# EAGLE design cryobondr-sense1-vlaqc-test1 (EAGLE 8.4.1)
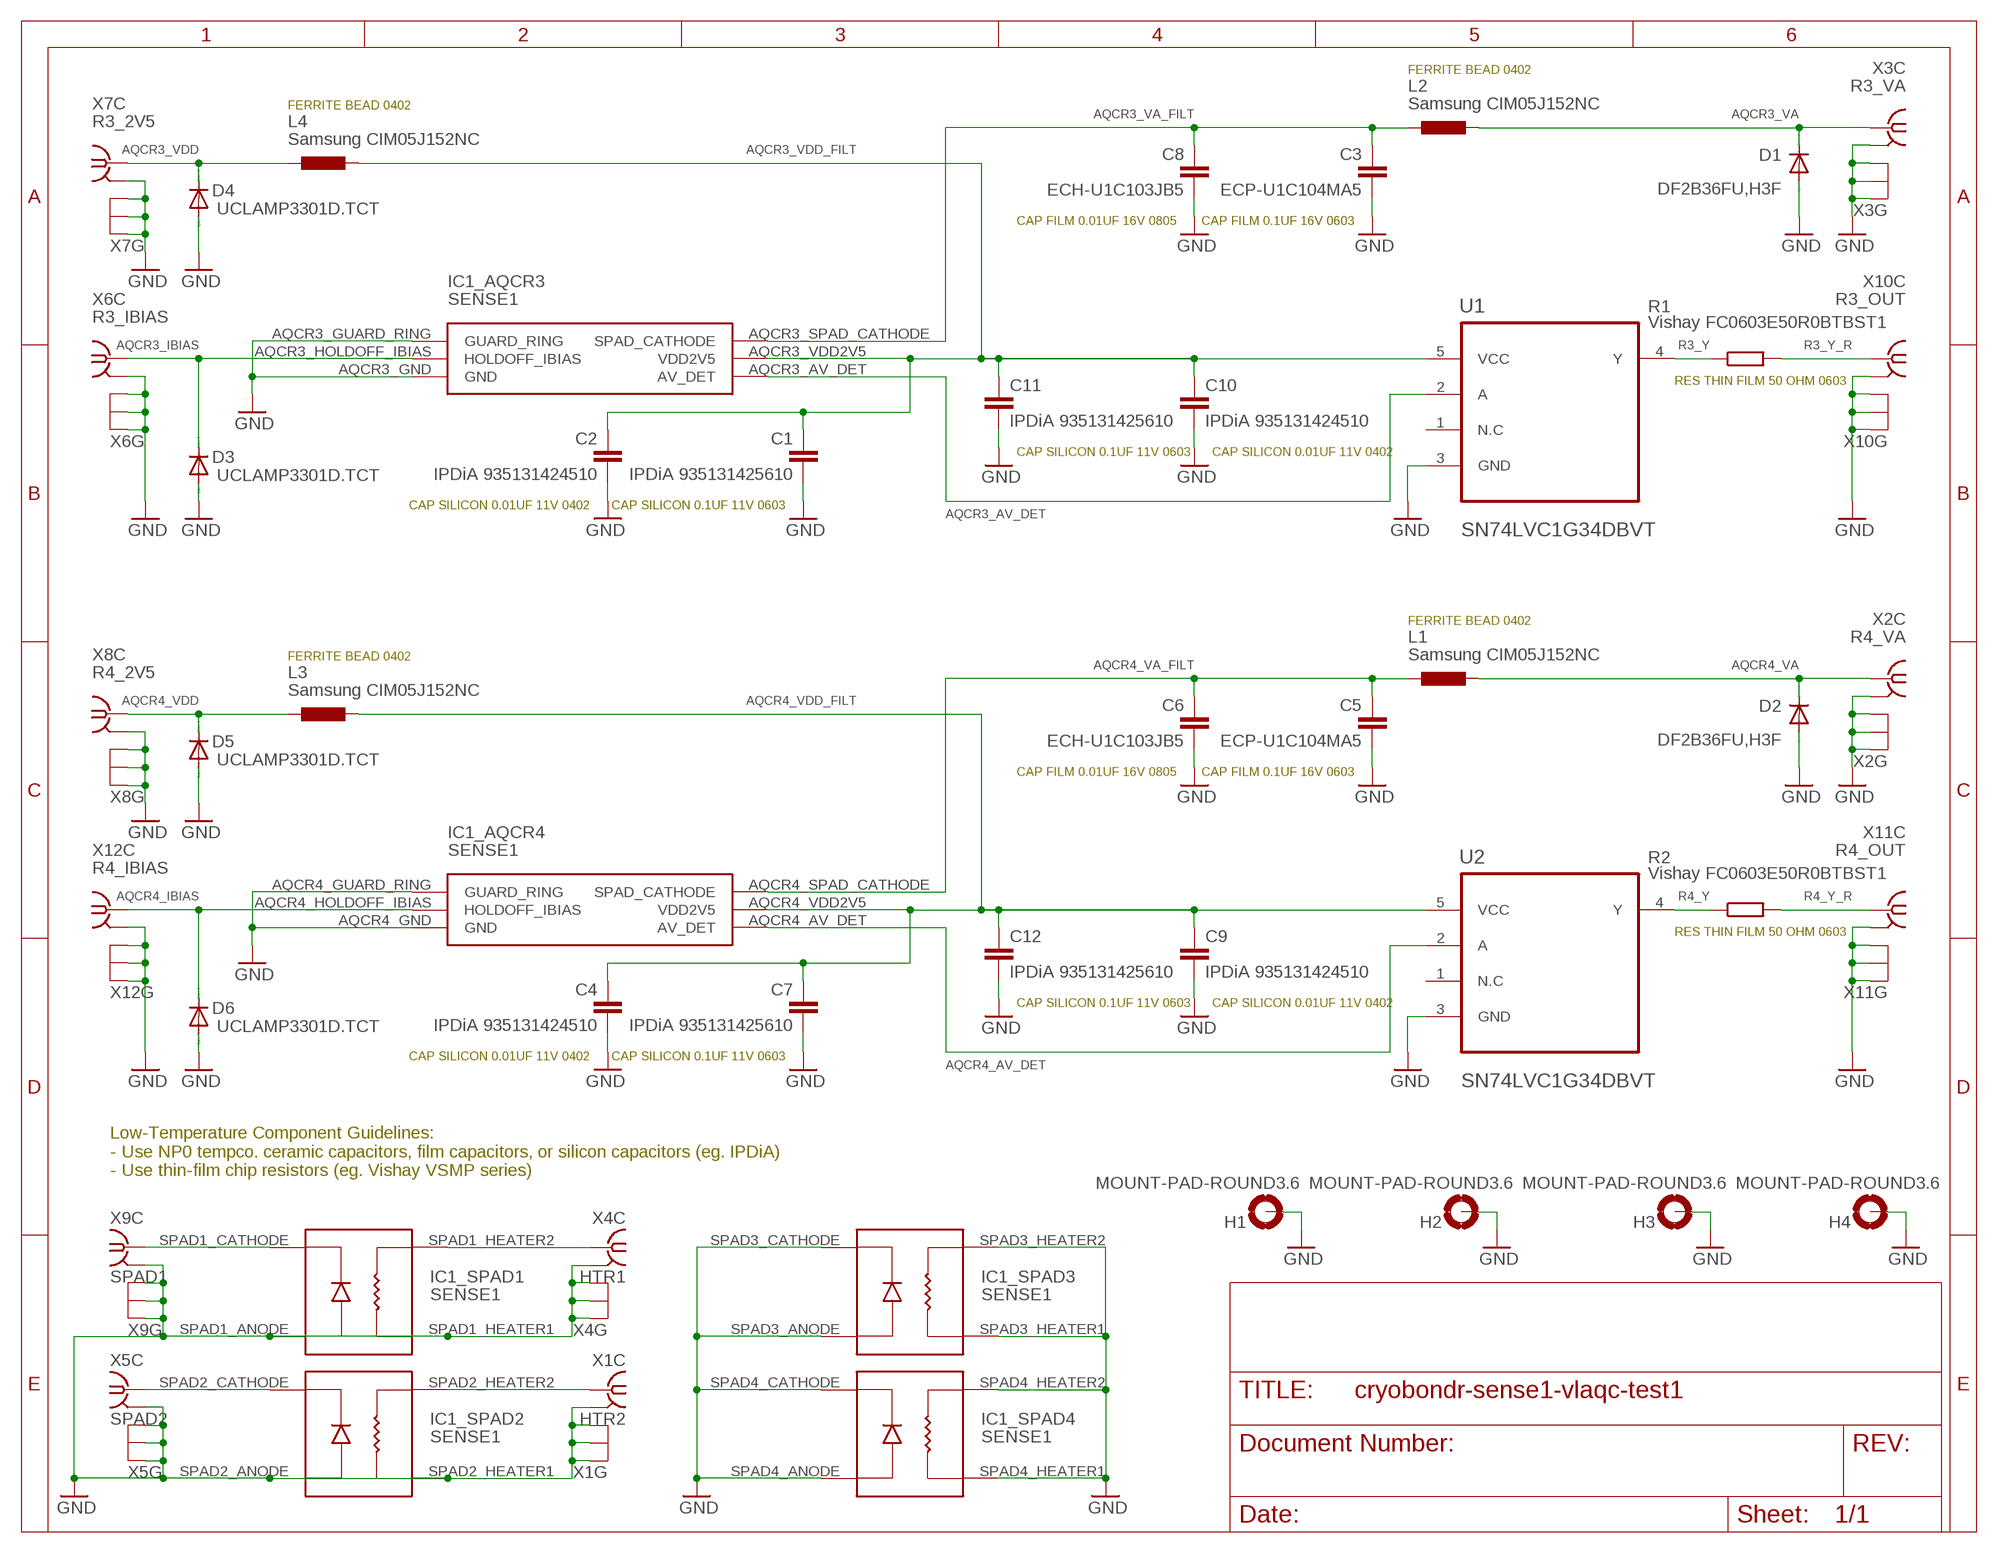
[diagram p0: schematic, sheet 1]

## Parts
C1  IPDiA 935131425610  C-EUC0603  [C0603]
C2  IPDiA 935131424510  C-EUC0402  [C0402]
C3  ECP-U1C104MA5  C-EUC0805  [C0805]
C4  IPDiA 935131424510  C-EUC0402  [C0402]
C5  ECP-U1C104MA5  C-EUC0805  [C0805]
C6  ECH-U1C103JB5  C-EUC0805  [C0805]
C7  IPDiA 935131425610  C-EUC0603  [C0603]
C8  ECH-U1C103JB5  C-EUC0805  [C0805]
C9  IPDiA 935131424510  C-EUC0402  [C0402]
C10  IPDiA 935131424510  C-EUC0402  [C0402]
C11  IPDiA 935131425610  C-EUC0603  [C0603]
C12  IPDiA 935131425610  C-EUC0603  [C0603]
D1  DF2B36FU,H3F  DIODE-SOD323-W  [SOD323-W]
D2  DF2B36FU,H3F  DIODE-SOD323-W  [SOD323-W]
D3  UCLAMP3301D.TCT  DIODE-SOD323-W  [SOD323-W]
D4  UCLAMP3301D.TCT  DIODE-SOD323-W  [SOD323-W]
D5  UCLAMP3301D.TCT  DIODE-SOD323-W  [SOD323-W]
D6  UCLAMP3301D.TCT  DIODE-SOD323-W  [SOD323-W]
H1  MOUNT-PAD-ROUND3.6  [3,6-PAD]
H2  MOUNT-PAD-ROUND3.6  [3,6-PAD]
H3  MOUNT-PAD-ROUND3.6  [3,6-PAD]
H4  MOUNT-PAD-ROUND3.6  [3,6-PAD]
IC1  SENSE1  SENSE1-WIREBOND-VLAQC-TEST1  [SENSE1-WIREBOND-VLAQC-TEST1]
L1  Samsung CIM05J152NC  INDUCTOR0402  [R0402]
L2  Samsung CIM05J152NC  INDUCTOR0402  [R0402]
L3  Samsung CIM05J152NC  INDUCTOR0402  [R0402]
L4  Samsung CIM05J152NC  INDUCTOR0402  [R0402]
R1  Vishay FC0603E50R0BTBST1  R-EU_R0603  [R0603]
R2  Vishay FC0603E50R0BTBST1  R-EU_R0603  [R0603]
U1  SN74LVC1G34DBVT  [SOT95P280X145-5N]
U2  SN74LVC1G34DBVT  [SOT95P280X145-5N]
X1  HTR2  MMCXBIGPAD  [MMCX-SMT-BIGPADS]
X2  R4_VA  MMCXBIGPAD  [MMCX-SMT-BIGPADS]
X3  R3_VA  MMCXBIGPAD  [MMCX-SMT-BIGPADS]
X4  HTR1  MMCXBIGPAD  [MMCX-SMT-BIGPADS]
X5  SPAD2  MMCXBIGPAD  [MMCX-SMT-BIGPADS]
X6  R3_IBIAS  MMCXBIGPAD  [MMCX-SMT-BIGPADS]
X7  R3_2V5  MMCXBIGPAD  [MMCX-SMT-BIGPADS]
X8  R4_2V5  MMCXBIGPAD  [MMCX-SMT-BIGPADS]
X9  SPAD1  MMCXBIGPAD  [MMCX-SMT-BIGPADS]
X10  R3_OUT  MMCXBIGPAD  [MMCX-SMT-BIGPADS]
X11  R4_OUT  MMCXBIGPAD  [MMCX-SMT-BIGPADS]
X12  R4_IBIAS  MMCXBIGPAD  [MMCX-SMT-BIGPADS]

## Nets
AQCR3_AV_DET: IC1.AQCR3_AV_DET(_AQCR3:AV_DET) U1.2(A)
AQCR3_IBIAS: D3.C IC1.AQCR3_HOLDOFF_IBIAS(_AQCR3:HOLDOFF_IBIAS) X6.S
AQCR3_VA: D1.C L2.2 X3.S
AQCR3_VA_FILT: C3.1 C8.1 IC1.AQCR3_SPAD_CATHODE(_AQCR3:SPAD_CATHODE) L2.1
AQCR3_VDD: D4.C L4.1 X7.S
AQCR3_VDD_FILT: C1.1 C2.1 C10.1 C11.1 IC1.AQCR3_VDD2V5(_AQCR3:VDD2V5) L4.2 U1.5(VCC)
AQCR4_AV_DET: IC1.AQCR4_AV_DET(_AQCR4:AV_DET) U2.2(A)
AQCR4_IBIAS: D6.C IC1.AQCR4_HOLDOFF_IBIAS(_AQCR4:HOLDOFF_IBIAS) X12.S
AQCR4_VA: D2.C L1.2 X2.S
AQCR4_VA_FILT: C5.1 C6.1 IC1.AQCR4_SPAD_CATHODE(_AQCR4:SPAD_CATHODE) L1.1
AQCR4_VDD: D5.C L3.1 X8.S
AQCR4_VDD_FILT: C4.1 C7.1 C9.1 C12.1 IC1.AQCR4_VDD2V5(_AQCR4:VDD2V5) L3.2 U2.5(VCC)
GND: C1.2 C2.2 C3.2 C4.2 C5.2 C6.2 C7.2 C8.2 C9.2 C10.2 C11.2 C12.2 D1.A D2.A D3.A D4.A D5.A D6.A H1.B3,6(MOUNT) H2.B3,6(MOUNT) H3.B3,6(MOUNT) H4.B3,6(MOUNT) IC1.AQCR3_GND(_AQCR3:GND) IC1.AQCR3_GUARD_RING(_AQCR3:GUARD_RING) IC1.AQCR4_GND(_AQCR4:GND) IC1.AQCR4_GUARD_RING(_AQCR4:GUARD_RING) IC1.SPAD1_ANODE(_SPAD1:SPAD_ANODE) IC1.SPAD1_HEATER1(_SPAD1:SPAD_HEATER1) IC1.SPAD2_ANODE(_SPAD2:SPAD_ANODE) IC1.SPAD2_HEATER1(_SPAD2:SPAD_HEATER1) IC1.SPAD3_ANODE(_SPAD3:SPAD_ANODE) IC1.SPAD3_CATHODE(_SPAD3:SPAD_CATHODE) IC1.SPAD3_HEATER1(_SPAD3:SPAD_HEATER1) IC1.SPAD3_HEATER2(_SPAD3:SPAD_HEATER2) IC1.SPAD4_ANODE(_SPAD4:SPAD_ANODE) IC1.SPAD4_CATHODE(_SPAD4:SPAD_CATHODE) IC1.SPAD4_HEATER1(_SPAD4:SPAD_HEATER1) IC1.SPAD4_HEATER2(_SPAD4:SPAD_HEATER2) U1.3(GND) U2.3(GND) X1.G1(C:GND) X1.G2(G:GND) X1.G3(G:GND) X1.G4(G:GND) X2.G1(C:GND) X2.G2(G:GND) X2.G3(G:GND) X2.G4(G:GND) X3.G1(C:GND) X3.G2(G:GND) X3.G3(G:GND) X3.G4(G:GND) X4.G1(C:GND) X4.G2(G:GND) X4.G3(G:GND) X4.G4(G:GND) X5.G1(C:GND) X5.G2(G:GND) X5.G3(G:GND) X5.G4(G:GND) X6.G1(C:GND) X6.G2(G:GND) X6.G3(G:GND) X6.G4(G:GND) X7.G1(C:GND) X7.G2(G:GND) X7.G3(G:GND) X7.G4(G:GND) X8.G1(C:GND) X8.G2(G:GND) X8.G3(G:GND) X8.G4(G:GND) X9.G1(C:GND) X9.G2(G:GND) X9.G3(G:GND) X9.G4(G:GND) X10.G1(C:GND) X10.G2(G:GND) X10.G3(G:GND) X10.G4(G:GND) X11.G1(C:GND) X11.G2(G:GND) X11.G3(G:GND) X11.G4(G:GND) X12.G1(C:GND) X12.G2(G:GND) X12.G3(G:GND) X12.G4(G:GND)
R3_Y: R1.1 U1.4(Y)
R3_Y_R: R1.2 X10.S
R4_Y: R2.1 U2.4(Y)
R4_Y_R: R2.2 X11.S
SPAD1_CATH: IC1.SPAD1_CATHODE(_SPAD1:SPAD_CATHODE) X9.S
SPAD1_HTR: IC1.SPAD1_HEATER2(_SPAD1:SPAD_HEATER2) X4.S
SPAD2_CATH: IC1.SPAD2_CATHODE(_SPAD2:SPAD_CATHODE) X5.S
SPAD2_HTR: IC1.SPAD2_HEATER2(_SPAD2:SPAD_HEATER2) X1.S
Unconnected: U1.1(N.C) U2.1(N.C)

## Notes on the sheet
- FERRITE BEAD 0402
- FERRITE BEAD 0402
- CAP FILM 0.01UF 16V 0805 | CAP FILM 0.1UF 16V 0603
- RES THIN FILM 50 OHM 0603
- CAP SILICON 0.1UF 11V 0603 | CAP SILICON 0.01UF 11V 0402
- CAP SILICON 0.01UF 11V 0402 | CAP SILICON 0.1UF 11V 0603
- FERRITE BEAD 0402
- FERRITE BEAD 0402
- CAP FILM 0.01UF 16V 0805 | CAP FILM 0.1UF 16V 0603
- RES THIN FILM 50 OHM 0603
- CAP SILICON 0.1UF 11V 0603 | CAP SILICON 0.01UF 11V 0402
- CAP SILICON 0.01UF 11V 0402 | CAP SILICON 0.1UF 11V 0603
- Low-Temperature Component Guidelines:
  - Use NP0 tempco. ceramic capacitors, film capacitors, or silicon capacitors (eg. IPDiA)
  - Use thin-film chip resistors (eg. Vishay VSMP series)

## Library data of the parts
C1-C12 = rcl-modified-footprints:C-EU: CAPACITOR, European symbol
D1-D6 = diode:DIODE-: DIODE
H1-H4 = holes:MOUNT-PAD-ROUND: MOUNTING PAD, round
IC1 = meng:SENSE1-WIREBOND-VLAQC-TEST1
L1-L4 = meng:INDUCTOR
R1 R2 = rcl-modified-footprints:R-EU_: RESISTOR, European symbol
U1 U2 = Texas Instruments_By_element14_Batch_1:SN74LVC1G34DBVT: SINGLE BUFFER GATE; MPN: SN74LVC1G34DBVT; OC_FARNELL: 1494933; OC_NEWARK: 01J0788; PACKAGE: SOT-5; SPICEPREFIX: X; SUPPLIER: TEXAS INSTRUMENTS
X1-X12 = meng:MMCX

## Net classes
0 default: width 0.152 mm, drill 0.2 mm, clearance 0.152 mm

## Board
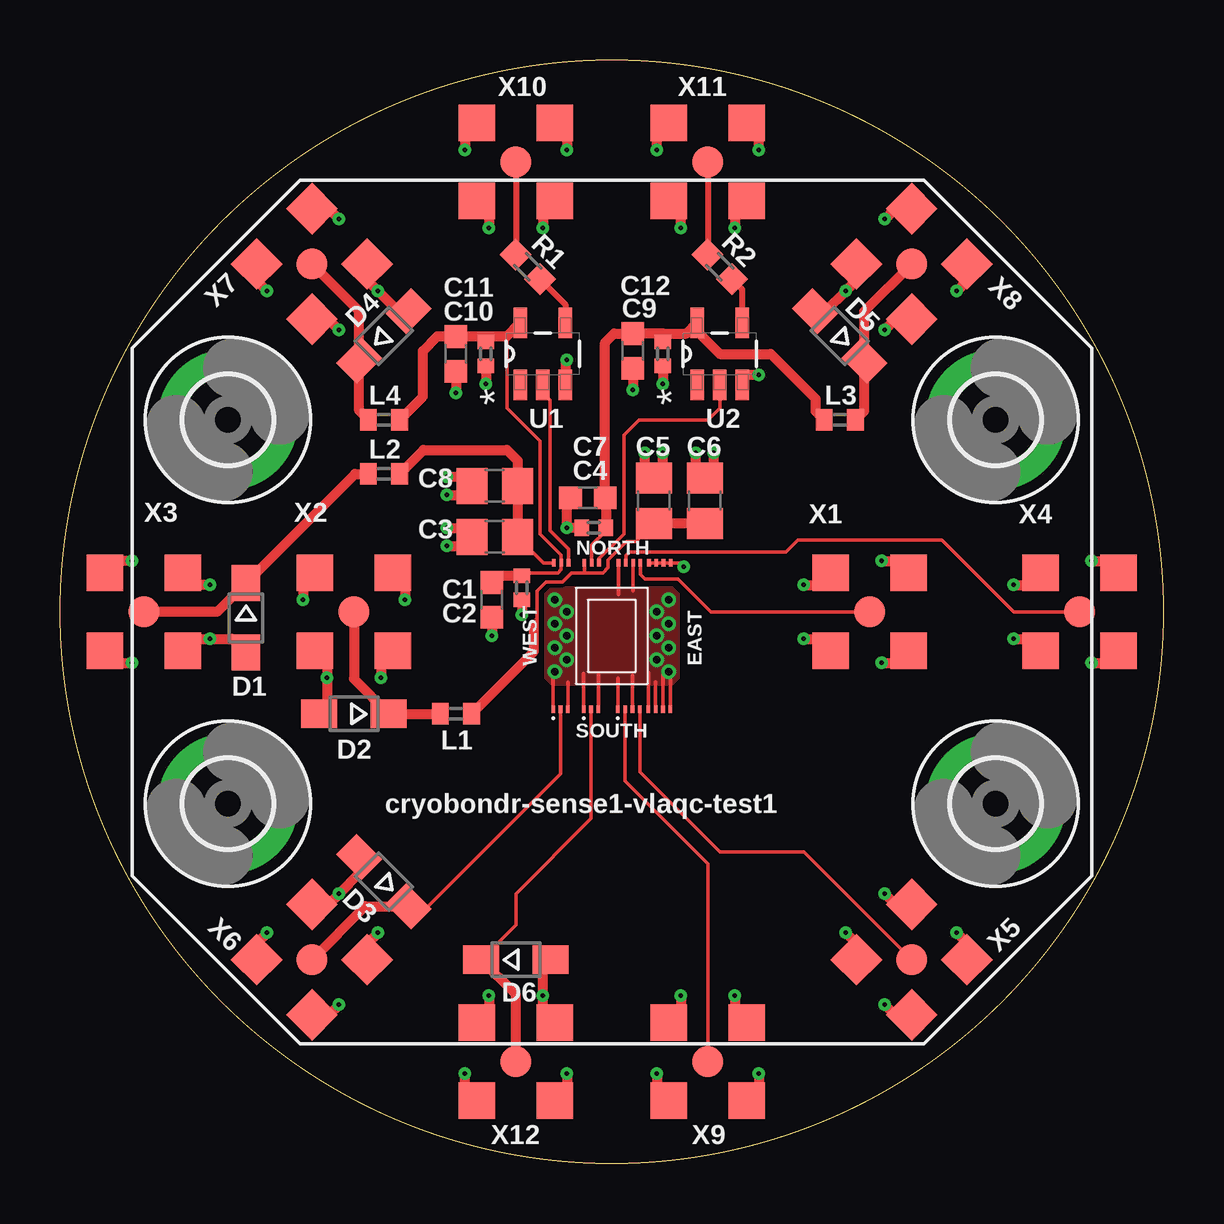
[diagram p1: board, top side]
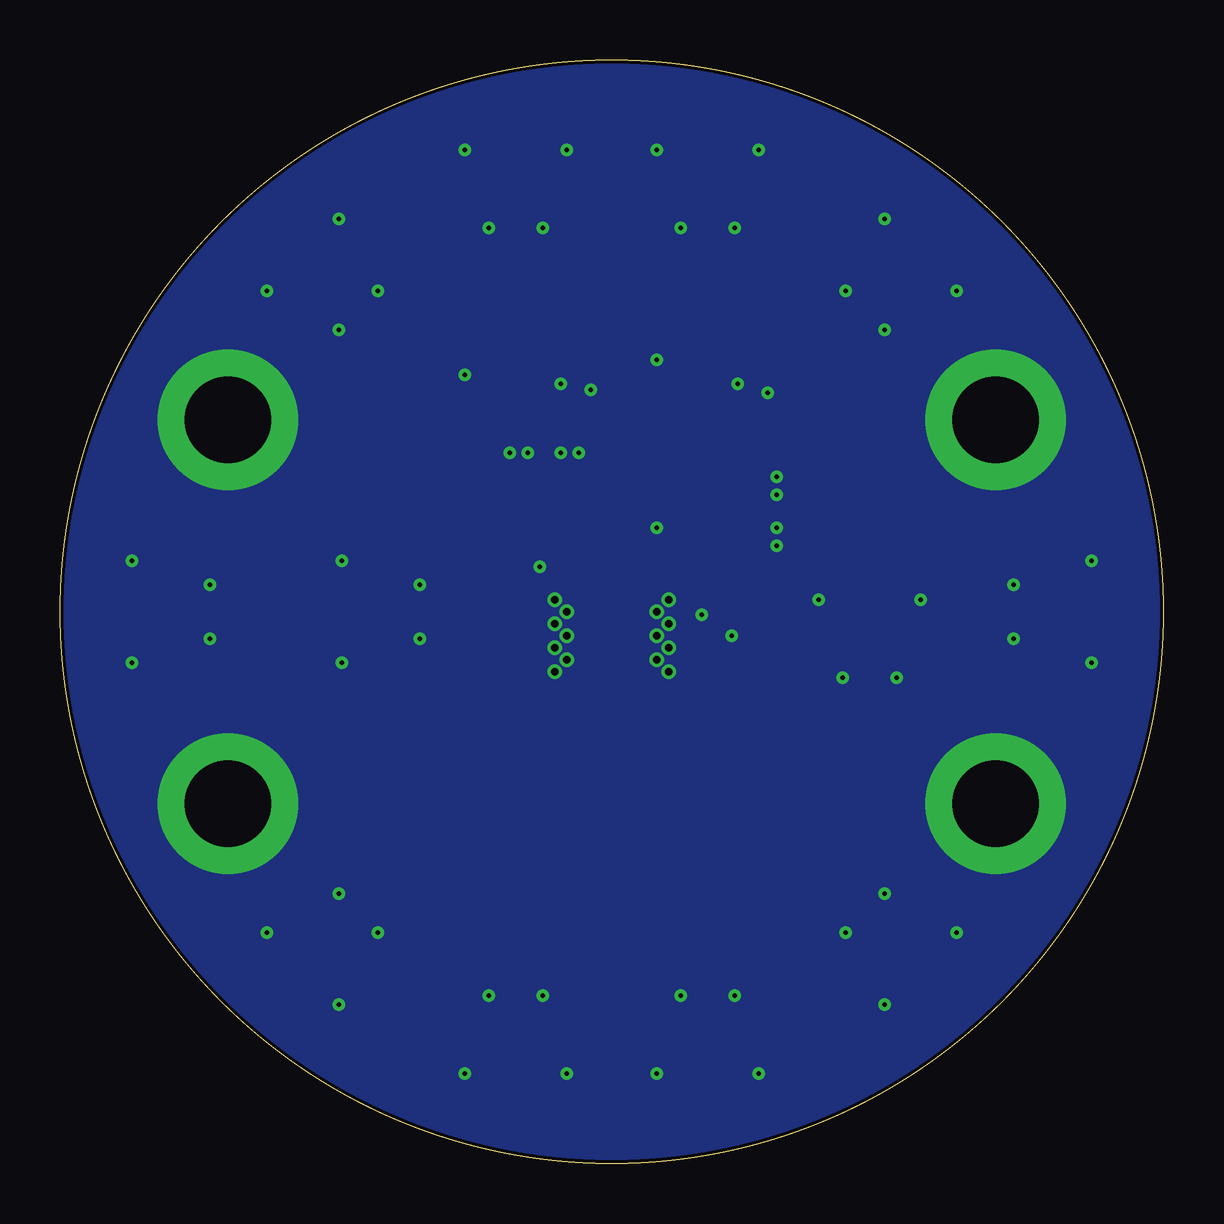
[diagram p2: board, bottom side, seen from below]

Size 46 x 46 mm. Coordinates in mm from the lower left corner, seen from the top.
Outline: circle at 23,23 radius 23
Copper layers (1*16): Top 0.035mm / dielectric 1.5mm / Bottom 0.035mm
Design rules "default *": minimum track width 6mil, minimum drill 0.2mm, track to track 6mil, track to pad 6mil, pad to pad 6mil, via to via 6mil, smd to smd 0mil, copper to edge 6mil, drill to drill 6mil, minimum pad ring 6mil, minimum via ring 6mil, stop-mask expansion 2mil, vias tented up to drill 1mm, thermal gap 6mil

### Footprints (pad centres in the part's own frame; a part is rotated, then mirrored left to right if it is on the bottom)
C0603 = smd 0.95 x 0.95: 1 -0.725,0; 2 0.725,0
C0402 = smd 0.6 x 0.7: 1 -0.5,0; 2 0.5,0
C0805 = smd 1.3 x 1.5: 1 -0.95,0; 2 0.95,0
SOD323-W = smd 1.5 x 1.2: A 1.45,0; C -1.45,0
3,6-PAD = drill 3.6 pad 5.842: B3,6 0,0
SENSE1-WIREBOND-VLAQC-TEST1 = smd 0.152 x 0.305: AQCR3_AV_DET -1.803,3.039; AQCR3_GND -1.829,-3.064; AQCR3_GUARD_RING -2.438,-3.064; AQCR3_HOLDOFF_IBIAS -2.134,-3.064; AQCR3_SPAD_CATHODE -2.413,3.039; AQCR3_VDD2V5 -2.108,3.039; AQCR4_AV_DET -0.533,3.039; AQCR4_GND -0.559,-3.064; AQCR4_GUARD_RING -1.168,-3.064; AQCR4_HOLDOFF_IBIAS -0.864,-3.064; AQCR4_SPAD_CATHODE -1.143,3.039; AQCR4_VDD2V5 -0.838,3.039; SPAD1_ANODE 0.254,-3.064; SPAD1_CATHODE 0.559,-3.064; SPAD1_HEATER1 0.279,3.039; SPAD1_HEATER2 0.584,3.039; SPAD2_ANODE 0.864,-3.064; SPAD2_CATHODE 1.168,-3.064; SPAD2_HEATER1 0.889,3.039; SPAD2_HEATER2 1.194,3.039; SPAD3_ANODE 1.829,-3.064; SPAD3_CATHODE 1.524,-3.064; SPAD3_HEATER1 1.549,3.039; SPAD3_HEATER2 1.854,3.039; SPAD4_ANODE 2.438,-3.064; SPAD4_CATHODE 2.134,-3.064; SPAD4_HEATER1 2.159,3.039; SPAD4_HEATER2 2.464,3.039
R0402 = smd 0.7 x 0.9: 1 -0.65,0; 2 0.65,0
R0603 = smd 0.95 x 0.95: 1 -0.725,0; 2 0.725,0
SOT95P280X145-5N = smd 1.27 x 0.559: 1 -1.295,0.94; 2 -1.295,0; 3 -1.295,-0.94; 4 1.295,-0.94; 5 1.295,0.94
MMCX-SMT-BIGPADS = smd 1.524 x 1.524: G1 -1.626,1.626; G2 1.626,1.626; G3 1.626,-1.626; G4 -1.626,-1.626 | smd 1.27 x 1.27: S 0,0

### Placement (x,y rotation side)
C1  18,23.5 270 top
C2  19.25,24 270 top
C3  18.12,26.12 180 top
C4  22.25,26.5 180 top
C5  24.75,27.62 90 top
C6  26.88,27.62 90 top
C7  22,27.75 180 top
C8  18.12,28.25 180 top
C9  25.12,33.75 270 top
C10  17.75,33.75 270 top
C11  16.5,33.75 270 top
C12  23.88,33.88 270 top
D1  7.75,22.75 270 top
D2  12.25,18.75 180 top
D3  13.5,11.75 135 top
D4  13.5,34.5 45 top
D5  32.5,34.5 135 top
D6  19,8.5 0 top
H1  39,15 0 top
H2  7,15 0 top
H3  39,31 0 top
H4  7,31 0 top
IC1  23,22 0 top
L1  16.5,18.75 180 top
L2  13.5,28.75 180 top
L3  32.5,31 180 top
L4  13.5,31 0 top
R1  19.5,37.38 135 top
R2  27.5,37.38 135 top
U1  20.12,33.75 90 top
U2  27.5,33.75 90 top
X1  33.75,23 0 top
X2  12.25,23 0 top
X3  3.5,23 0 top
X4  42.5,23 0 top
X5  35.5,8.5 45 top
X6  10.5,8.5 45 top
X7  10.5,37.5 45 top
X8  35.5,37.5 45 top
X9  27,4.25 0 top
X10  19,41.75 0 top
X11  27,41.75 0 top
X12  19,4.25 0 top

### Tracks (layer width: path | path; a pad name or v marks a point on that pad's centre or on a via)
AQCR3_AV_DET
  Top 0.152: U1.2 20.12,32.12 20.43,31.82 20.43,26.38 21.2,25.61 IC1.AQCR3_AV_DET
AQCR3_IBIAS
  Top 0.152: IC1.AQCR3_HOLDOFF_IBIAS 20.87,16.24 15.35,10.72 D3.C
  Top 0.406: X6.S 12.72,10.72 D3.C
AQCR3_VA
  Top 0.406: X3.S 6.55,23 D1.C 12.3,28.75 L2.2
AQCR3_VA_FILT
  Top 0.152: IC1.AQCR3_SPAD_CATHODE 20.16,25.04 C3.1
  Top 0.406: C3.1 C8.1 19.07,29.3 18.62,29.75 15.15,29.75 L2.1
AQCR3_VDD
  Top 0.406: 12.47,33.62 12.47,35.52 X7.S | 12.47,33.62 D4.C | L4.1 12.47,31.38 12.47,33.62
AQCR3_VDD_FILT
  Top 0.152: 18.62,34.48 18.62,34.47 18.62,31.5 20,30.12 20,26.25 20.89,25.36 IC1.AQCR3_VDD2V5 20.89,24.77 20.75,24.62 19.38,24.62 C2.1
  Top 0.406: 17.75,34.48 C11.1 15.72,34.48 15.12,33.88 15.12,31.98 L4.2 | 17.75,34.48 18.62,34.48 U1.5 | C10.1 17.75,34.48 | C1.1 18.27,24.5 C2.1
AQCR4_AV_DET
  Top 0.152: IC1.AQCR4_AV_DET 22.47,25.22 23.5,26.25 23.5,30.38 24.12,31 27,31 27.5,31.5 U2.2
AQCR4_IBIAS
  Top 0.152: IC1.AQCR4_HOLDOFF_IBIAS 22.14,14.39 19,11.25 19,9.95 D6.C
  Top 0.406: X12.S 19,7.05 D6.C
AQCR4_VA
  Top 0.406: X2.S 12.25,20.2 D2.C L1.2
AQCR4_VA_FILT
  Top 0.152: 19.75,22.38 19.88,22.25 19.88,23.88 20.25,24.25 20.94,24.25 21.32,24.62 21.88,24.62 | 21.88,24.62 22.62,24.62 22.85,24.85 22.85,25.16 23.62,25.93 24,25.93 C5.1 | IC1.AQCR4_SPAD_CATHODE 21.86,24.64 21.88,24.62
  Top 0.406: C6.1 C5.1 | L1.1 19.75,21.35 19.75,22.38
  pour Top: 19.88,22.75 19.88,22.25 19.62,22.25 19.62,22.5
AQCR4_VDD
  Top 0.406: X8.S 33.52,35.52 D5.C 33.52,31.38 L3.1
AQCR4_VDD_FILT
  Top 0.152: C4.1 22.75,26.38 22.16,25.79 IC1.AQCR4_VDD2V5
  Top 0.406: 25.12,34.6 C12.1 23.1,34.6 22.73,34.23 C7.1 22.75,27.73 C4.1 | 25.12,34.6 26.12,34.6 U2.5 26.56,34.69 27.5,33.75 29.62,33.75 31.5,31.88 31.5,31.35 L3.2 | C9.1 25.12,34.6
GND  (via drill 0.2, 0.3)
  Top 0.152: IC1.SPAD1_HEATER1 23.28,23.72 | IC1.SPAD3_HEATER1 IC1.SPAD3_HEATER2 IC1.SPAD4_HEATER1 IC1.SPAD4_HEATER2 25.84,25.04 v26,24.88 | IC1.SPAD2_HEATER1 23.89,23.86 | IC1.AQCR3_GUARD_RING 20.56,20.31 | IC1.AQCR3_GND 21.17,20.08 | IC1.AQCR4_GUARD_RING 21.83,20.42 | IC1.AQCR4_GND 22.44,20.44 | IC1.SPAD1_ANODE 23.25,20.25 | IC1.SPAD2_ANODE 23.86,20.36 | IC1.SPAD3_CATHODE 24.52,20.48 | IC1.SPAD3_ANODE 24.83,20.08 | IC1.SPAD4_CATHODE 25.13,20.38 | IC1.SPAD4_ANODE 25.44,20.31
  Top 0.406: C2.2 v19.25,22.88 | C1.2 v18,22 | X10.G2 21.12,42.88 v21.12,42.25 | X10.G1 16.88,42.88 v16.88,42.25 | X10.G4 17.88,39.62 v17.88,39 | X10.G3 20.12,39.62 v20.12,39 | X11.G3 28.12,39.62 v28.12,39 | v25.88,39 25.88,39.62 X11.G4 | v24.88,42.25 24.88,42.88 X11.G1 | v29.12,42.25 29.12,42.88 X11.G2 | v17.88,7 17.88,6.38 X12.G1 | X12.G2 20.12,6.38 v20.12,7 20.12,8.18 D6.A | v21.12,3.75 21.12,3.12 X12.G3 | X12.G4 16.88,3.12 v16.88,3.75 | C9.2 v25.12,32.5 | C12.2 v23.88,32.25 | C10.2 v17.75,32.5 | C11.2 v16.5,32.12 | X2.G2 14.38,24.13 v14.38,23.5 | X2.G1 10.12,24.13 v10.12,23.5 | X2.G4 11.12,20.87 v11.12,20.25 11.12,19.07 D2.A | X2.G3 13.38,20.87 v13.38,20.25 | X3.G4 2.37,20.88 v3,20.88 | v3,25.12 2.37,25.12 X3.G1 | v6.25,24.12 5.63,24.12 X3.G2 | X3.G3 5.63,21.88 v6.25,21.88 7.18,21.88 D1.A | v11.62,6.62 11.2,6.2 X6.G4 | v8.62,9.62 8.2,9.2 X6.G1 | X6.G2 11.17,10.8 v11.62,11.25 12.47,12.1 D3.A | v13.25,9.62 12.8,9.17 X6.G3 | X8.G1 33.2,36.83 v32.75,36.38 31.9,35.52 D5.A | v34.38,34.75 34.83,35.2 X8.G4 | v37.38,36.38 37.8,36.8 X8.G3 | v34.38,39.38 34.8,39.8 X8.G2 | v8.62,36.38 8.2,36.8 X7.G1 | v11.62,39.38 11.2,39.8 X7.G2 | X7.G3 12.8,36.83 v13.25,36.38 14.1,35.52 D4.A | v11.62,34.75 11.17,35.2 X7.G4 | v24.88,3.75 24.88,3.12 X9.G4 | v29.12,3.75 29.12,3.12 X9.G3 | v28.12,7 28.12,6.38 X9.G2 | v25.88,7 25.88,6.38 X9.G1 | v43,20.88 43.63,20.88 X4.G3 | v39.75,21.88 40.37,21.88 X4.G4 | v39.75,24.12 40.37,24.12 X4.G1 | v43,25.12 43.63,25.12 X4.G2 | 17.15,28.27 C8.2 | 17.15,28.27 16.8,28.62 v16.12,28.62 | v16.12,27.88 16.75,27.88 17.15,28.27 | v16.12,26.5 16.8,26.5 C3.2 16.8,25.75 v16.12,25.75 | v26.5,29.62 26.5,28.95 C6.2 27.25,28.95 v27.25,29.62
  Top 0.406: v25.12,29.62 25.12,28.95 C5.2 24.38,28.95 v24.38,29.62 | C4.2 v21.12,26.5 21.12,27.6 C7.2 | v31,24.12 31.62,24.12 X1.G1 | v34.25,25.12 34.88,25.12 X1.G2 | v31,21.88 31.62,21.88 X1.G4 | v34.25,20.88 34.88,20.88 X1.G3 | X5.G1 33.2,9.17 v32.75,9.62 | X5.G2 34.83,10.8 v34.38,11.25 | v37.38,9.62 37.8,9.2 X5.G3 | v34.38,6.62 34.8,6.2 X5.G4 | v29.12,32.88 28.44,32.88 U2.3 | v21.12,33.5 21.07,33.5 U1.3
  other vias: 20.62,23.5 20.62,22.5 20.62,21.5 20.62,20.5 25.38,22.5 25.38,21.5 25.38,20.5 25.38,23.5 21.12,23 21.12,22 21.12,21 24.88,21 24.88,22 24.88,23
  pour Bottom (no thermals): 0,0 46,0 46.25,46 0.25,46
  pour Top: 20.25,20.25 20.5,20 25.5,20 25.75,20.25 25.75,23.75 25.5,24 20.5,24 20.25,23.75
R3_Y
  Top 0.254: R1.1 21.07,35.81 U1.4
R3_Y_R
  Top 0.254: X10.S R1.2
R4_Y
  Top 0.254: U2.4 28.44,36.44 R2.1
R4_Y_R
  Top 0.254: X11.S R2.2
SPAD1_CATH
  Top 0.152: IC1.SPAD1_CATHODE 23.56,15.94 27,12.5 X9.S
SPAD1_HTR
  Top 0.152: IC1.SPAD1_HEATER2 23.58,25.33 23.75,25.5 30.25,25.5 30.75,26 36.75,26 39.75,23 X4.S
SPAD2_CATH
  Top 0.152: X5.S 31,13 27.5,13 24.17,16.33 IC1.SPAD2_CATHODE
SPAD2_HTR
  Top 0.152: IC1.SPAD2_HEATER2 24.19,24.56 24.38,24.38 25.75,24.38 27.12,23 X1.S

### Text on the board
tPlace: NORTH | WEST | EAST | SOUTH | cryobondr-sense1-vlaqc-test1